# EAGLE design 125_38kHz IR (EAGLE 9.2.2)
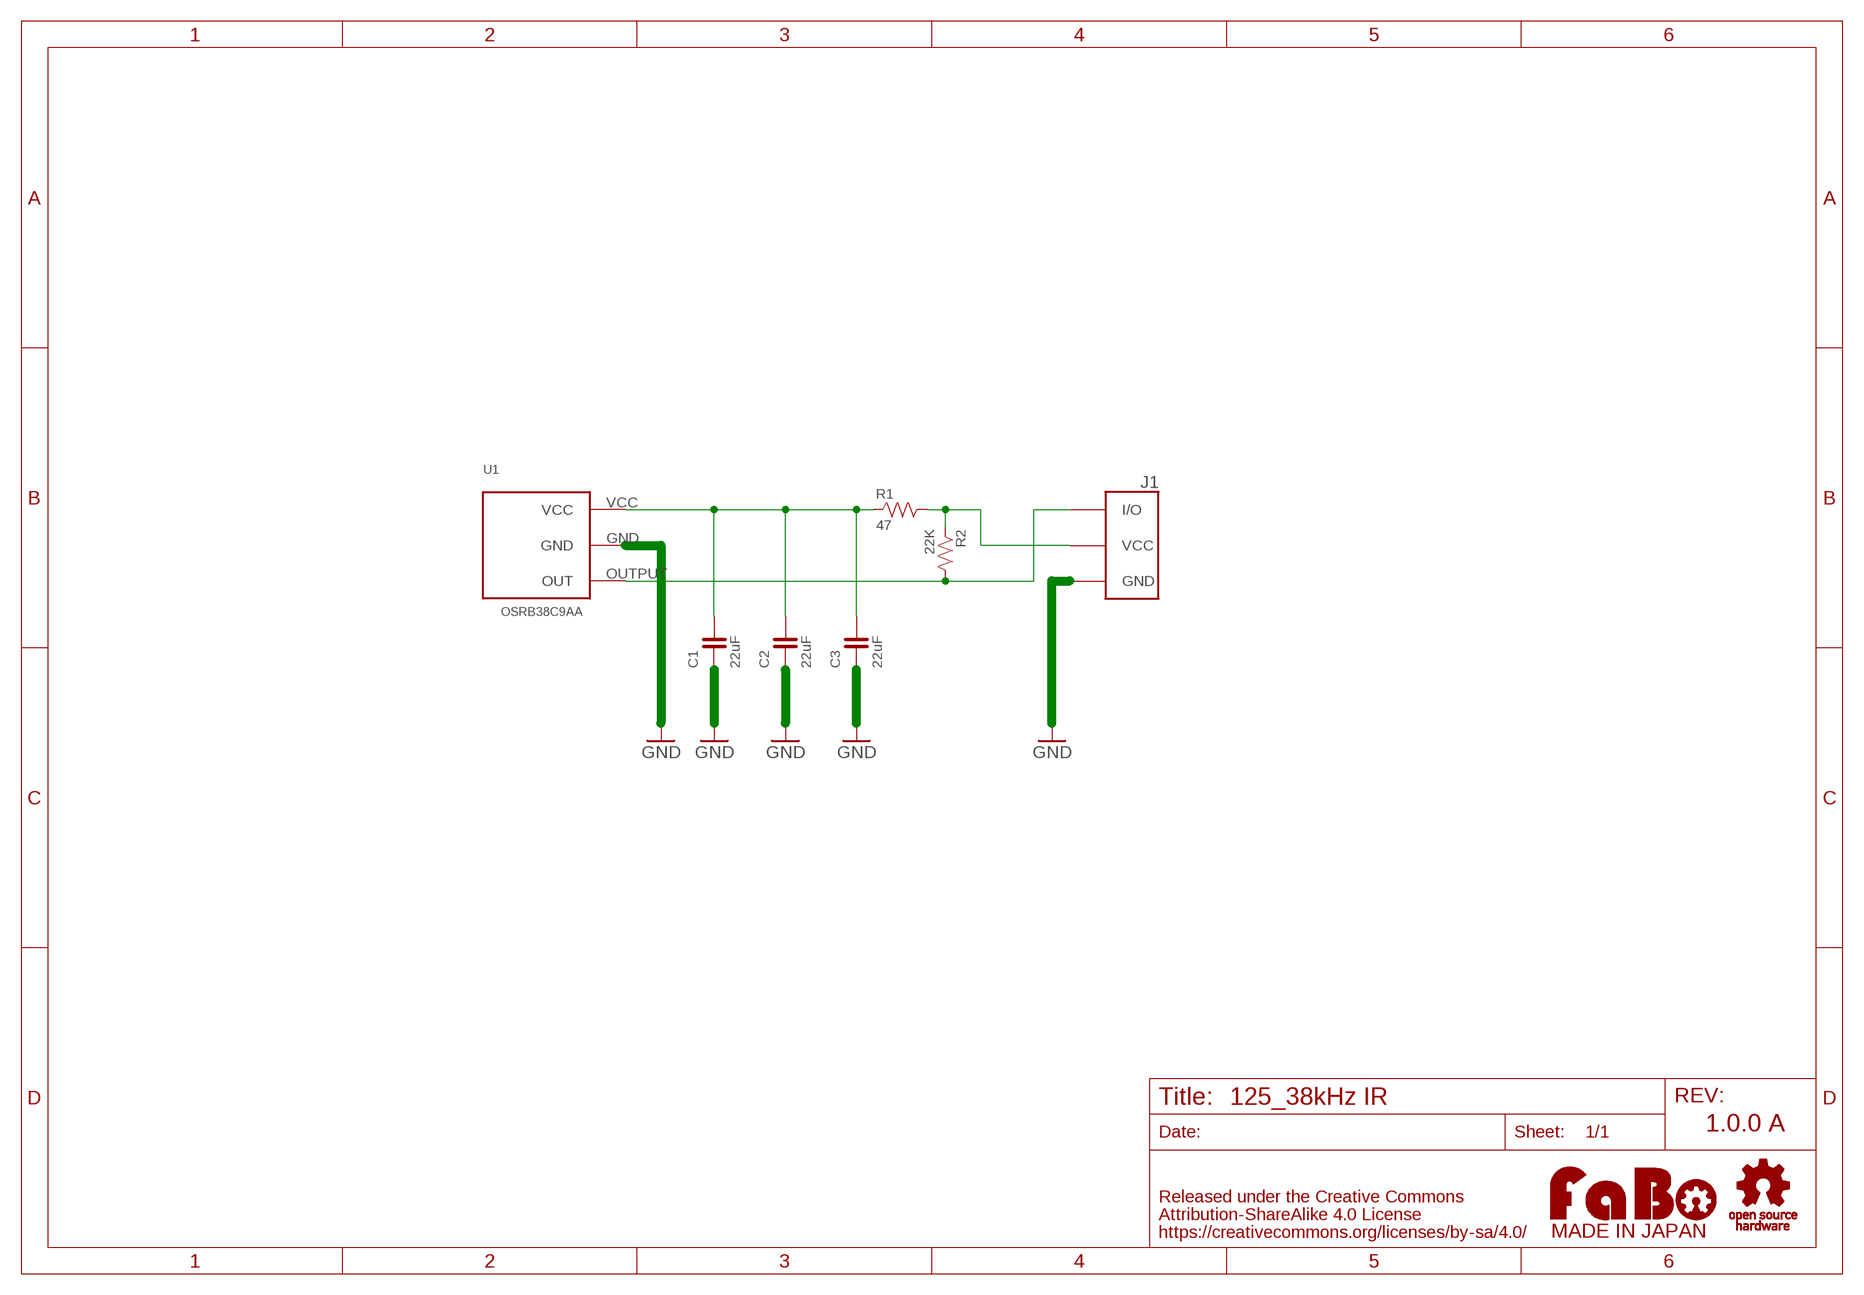
[diagram p0: schematic, sheet 1]

## Parts
C1  22uF  CAPACITOR-0805  [0805]
C2  22uF  CAPACITOR-0805  [0805]
C3  22uF  CAPACITOR-0805  [0805]
J1  FABO_BRICK_3PIN  [FABO_BRICK_3PIN]
R1  47  RESISTOR-0603  [0603]
R2  22K  RESISTOR-0603  [0603]
U1  OSRB38C9AA  [OSRB38C9AA]
U$2  LOGO_OSHW-M  [LOGO_OSHW_M]
U$3  LOGO_FABO-M_BOTTOM  [LOGO_FABO_MS_BOTTOM]

## Nets
GND: C1.1 C2.1 C3.1 J1.GND U1.GND
N$1: C1.2 C2.2 C3.2 R1.1 U1.VCC
N$2: J1.VCC R1.2 R2.1
N$4: J1.I/O R2.2 U1.OUTPUT(OUT)

## Notes on the sheet
- 1.0.0 A

## Library data of the parts
C1-C3 = FaBo-Capacitor:CAPACITOR: CAPACITOR
J1 = FaBo-Template:FABO_BRICK_3PIN: FaBo Brick 3pin
R1 R2 = FaBo-Resistors:RESISTOR: RESISTOR
U1 = FaBo-etc:OSRB38C9AA
U$2 = FaBo-etc:LOGO_OSHW
U$3 = FaBo-etc:LOGO_FABO

## Board
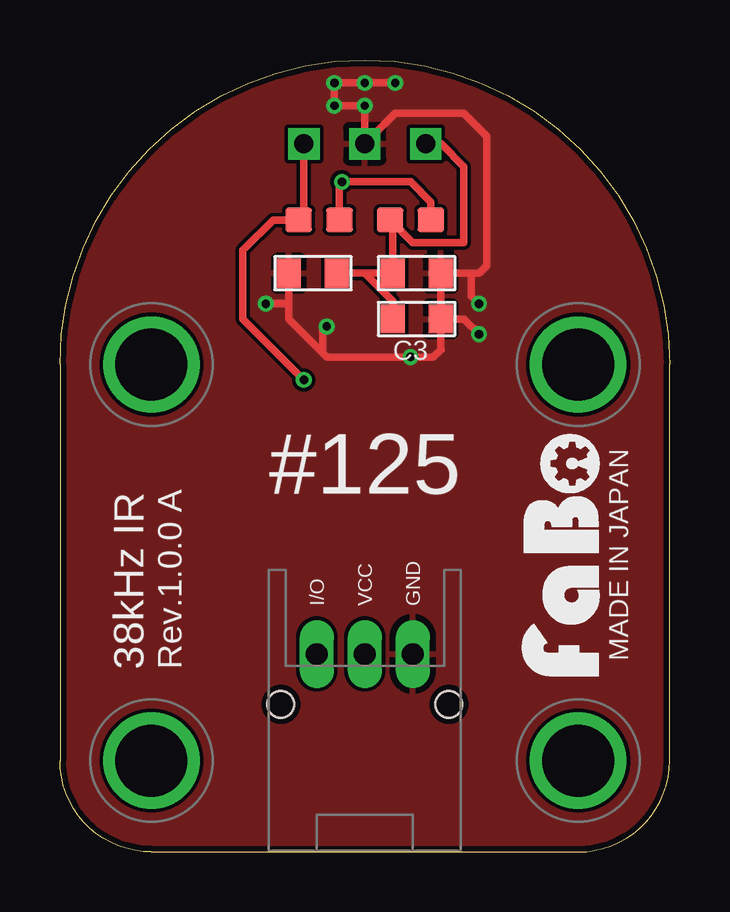
[diagram p1: board, top side]
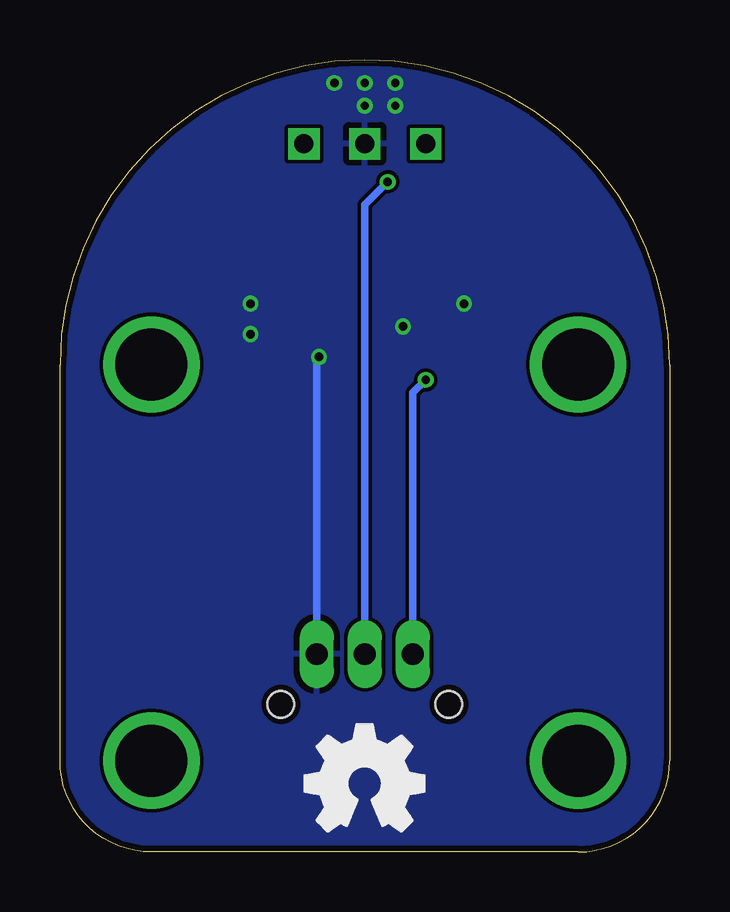
[diagram p2: board, bottom side, seen from below]

Size 25.4 x 33.02 mm. Coordinates in mm from the lower left corner, seen from the top.
Copper layers (1*16): Top 0.035mm / dielectric 1.5mm / Bottom 0.035mm
Design rules "SeeedStudio_2layer_DRU_no_angle_20140221": minimum track width 6mil, minimum drill 12mil, track to track 6mil, track to pad 6mil, pad to pad 6mil, via to via 6mil, smd to smd 0mil, copper to edge 10mil, drill to drill 10mil, minimum pad ring 10mil, minimum via ring 6mil, stop-mask expansion 2mil, vias tented up to drill 100mil, thermal gap 10mil

### Footprints (pad centres in the part's own frame; a part is rotated, then mirrored left to right if it is on the bottom)
0805 = smd 1 x 1.2: 1 -1.254,0; 2 0.746,0
FABO_BRICK_3PIN = drill 0.9 pad 1.422 long: GND 2,-8.255; I/O -2,-8.255; VCC 0,-8.255 | drill 3 pad 3.81: P$1 -8.89,3.81; P$2 8.89,3.81; P$3 -8.89,-12.7; P$4 8.89,-12.7 | hole 1.1: -3.5,-10.355; 3.5,-10.355
0603 = smd 1.1 x 1: 1 -0.85,0; 2 0.85,0
OSRB38C9AA = drill 0.8 square: GND 0,0; OUTPUT -2.54,0; VCC 2.54,0

### Placement (x,y rotation side)
C1  14.61,24.13 180 top
C2  10.79,24.13 0 top
C3  14.61,22.23 180 top
J1  12.7,16.51 0 top
R1  14.61,26.35 0 top
R2  10.79,26.35 180 top
U1  12.7,29.53 0 top
U$2  12.7,2.86 0 bottom
U$3  22.86,12.38 270 bottom

### Tracks (layer width: path | path; a pad name or v marks a point on that pad's centre or on a via)
GND  (via drill 0.35)
  Top 0.305: 17.14,24.13 17.46,24.13 17.78,24.45 17.78,29.84 16.83,30.8 13.97,30.8 U1.GND v12.7,31.11 v11.43,31.11 v11.43,32.07 v12.7,32.07 v13.97,32.07 | 17.14,24.13 15.88,24.13 | 15.88,24.13 C1.1 | 9.84,23.83 C2.1 9.54,22.86 | C3.1 15.86,20.97 15.88,20.95 15.56,20.64 v14.61,20.64 11.11,20.64 10.95,20.8 | C3.1 15.86,24.11 15.88,24.13 | 9.54,22.86 9.54,22.21 10.95,20.8 | v8.57,22.86 9.54,22.86 | v11.11,21.91 10.95,21.75 10.95,20.8 | v17.46,21.59 16.83,22.23 C3.1 | v17.46,22.86 17.14,23.18 17.14,24.13
  Bottom 0.305: J1.GND 14.7,20.54 v14.61,20.64
  pour Bottom: 0,0 25.4,0 25.4,33.66 0,33.66
  pour Top: 0,0 25.4,0 25.4,33.66 0,33.66
N$1
  Top 0.305: C2.2 12.7,24.13 | 12.7,24.13 C1.2 13.86,26.25 R1.1 14.71,25.4 16.83,25.4 16.83,28.57 15.88,29.53 U1.VCC | 12.7,24.13 13.86,22.97 C3.2 | 12.7,24.13
N$2  (via drill 0.35)
  Top 0.305: R2.1 11.64,27.84 v11.75,27.94 14.61,27.94 15.46,27.09 R1.2
  Bottom 0.305: J1.VCC 12.7,26.99 v11.75,27.94
N$4  (via drill 0.35)
  Top 0.305: v10.16,19.68 7.62,22.23 7.62,25.08 8.89,26.35 R2.2 10.16,26.57 U1.OUTPUT
  Bottom 0.305: J1.I/O 10.7,19.14 v10.16,19.68

### Text on the board
tPlace: #125 | MADE IN JAPAN | 38kHz IR | Rev.1.0.0 A